# EasyEDA Pro project Complete_project.epro, board PCB9
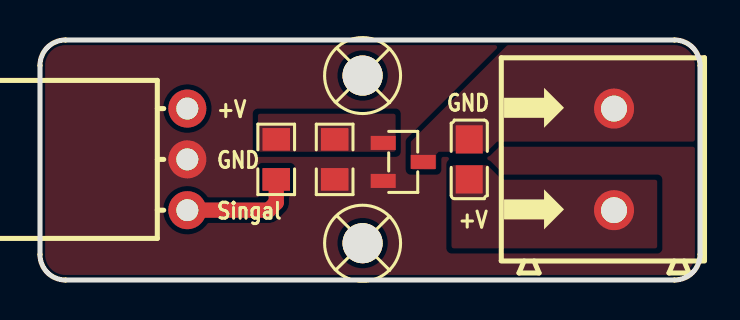
[diagram p16: board, top side]
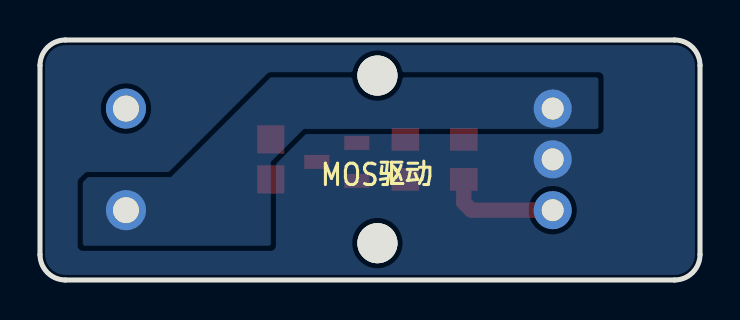
[diagram p17: board, bottom side, seen from below]

Outline 33 x 12 mm; copper layers: Top Layer, Bottom Layer. Coordinates in mm from the lower left corner of the outline.
Outline path: 0,10.73 0,1.27 arc(0.37,0.37) 1.27,0 31.73,0 arc(32.63,0.37) 33,1.27 33,10.73 arc(32.63,11.63) 31.73,12 1.27,12 arc(0.37,11.63) 0,10.73
Stack: Top Layer 0.035mm / Dielectric1 1.51mm FR4 er 4.5 / Bottom Layer 0.035mm

## Design rules (mm)
template: 自定义配置
spacing copperThickness1oz (default): track to track 0.102, other pairs 0.152 to 0.3
spacing copperThickness2oz: track to track 0.203, other pairs 0.152 to 0.3
track width copperThickness1oz (default): min 0.127, default 0.254, max 2.54
track width copperThickness2oz: min 0.203, default 0.254, max 2.54
differential pair differentialPair (default): width min 0.127, default 0.254, max 2.54; gap min 0.152, default 0.152
via viaSize (default): diameter min 0.5, default 0.61, max 10; hole min 0.3, default 0.305, max 6.3

## Placement (name value [footprint] x y rotation side)
C1  100nF  [C0805]  21.46 6.03 270 top
P1  WJ500V-5.08-2P  [CONN-TH_2P-P5.00_WJ500V-5.08-2P]  28.7 6.03 90 top
Q1  -  [SOT-23-3_L2.9-W1.3-P1.90-LS2.4-BR]  18.16 5.9 180 top
R1  20  [R0805]  11.81 6.03 90 top
R2  1k  [R0805]  14.73 6.03 90 top
SCREW1  -  [M2螺丝]  16.13 10.22 0 top
SCREW2  -  [M2螺丝]  16.13 1.84 0 top
U1  PM254-1-03-W-8.5  [HDR-TH_3P-P2.54-H-F-W10.0-N]  7.37 6.03 270 top

## Footprints (pads in the part's own frame, mm; a bottom-side part is the same pattern mirrored in y, then rotated)
C0805
  rect 1.41x1.35 smd: 1(-1,0) 2(1,0)
CONN-TH_2P-P5.00_WJ500V-5.08-2P
  round 2 hole 1.3: 1(-2.54,0) 2(2.54,0)
HDR-TH_3P-P2.54-H-F-W10.0-N
  round 1.9 hole 1.1: 1(-2.54,0) 2(0,0) 3(2.54,0)
M2螺丝
  round 2 hole 2: 1(0,0)
R0805
  rect 1.133x1.377 smd: 1(-1,0) 2(1,0)
SOT-23-3_L2.9-W1.3-P1.90-LS2.4-BR
  rect 1.25x0.7 smd: 1(1,-0.95) 2(1,0.95) 3(-1,0)

## Nets
As in the schematic.

Pads without a net: SCREW1 1; SCREW2 1

## Routing (per net, layer and track width the routed paths; a pad name or vN(x,y) marks a point on that pad's centre or on a via; arc(x,y) is an arc through that point)
HOT: length 5.8
  Top Layer w0.762: U1.3 11.43,3.49 11.81,3.87 R1.1

## Copper pours and planes (outline as drawn; the poured copper is in the pictures)
+5V on Top Layer: 20.57,5.78 20.61,5.74 22.37,5.74 23.1,5.02 30.86,5.02 30.86,1.59 20.57,1.59
+5V on Bottom Layer: 21.46,10.13 5.08,10.13 5.08,7.56 19.81,7.56 21.46,5.9 21.46,1.71 30.86,1.71 30.86,4.89 30.61,5.14 26.45,5.14
GND on Top Layer: -3.56,12.76 35.05,12.76 35.05,-1.21 -3.56,-1.21
GND on Bottom Layer: -5.59,14.92 36.07,14.92 36.07,-2.6 -5.59,-2.6
$1N246 on Top Layer: 19.81,6.29 19.81,5.52 18.54,5.52 18.54,6.92 24.13,12.51 33.91,12.51 33.91,6.92 22.85,6.92 22.37,6.43 20.59,6.43 20.57,6.41 19.94,6.41
$1N249 on Top Layer: 10.89,8.31 17.78,8.31 17.78,6.41 10.89,6.41

## Text on the board
Bottom Silkscreen Layer: MOS驱动
Top Silkscreen Layer: GND | +V | Singal
